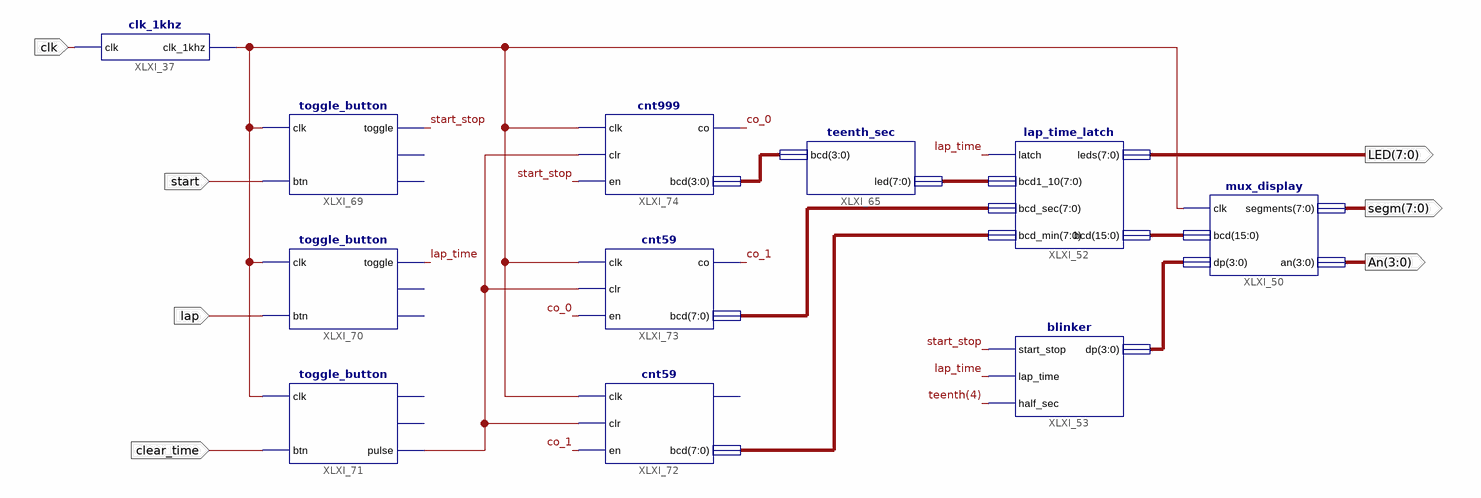
[diagram p0: schematic sheet 1]
// Xilinx ISE schematic top_layer.sch (spartan3e) as structural Verilog: 11 symbols, 7 ports
module top_layer (
  input  start,
  input  lap,
  input  clear_time,
  input  clk,
  output [7:0] LED,
  output [7:0] segm,
  output [3:0] An
);

  wire co_0, co_1, lap_time, start_stop, XLXN_136, XLXN_228;
  wire [3:0] XLXN_175, XLXN_197;
  wire [7:0] teenth, XLXN_178, XLXN_179;
  wire [15:0] XLXN_180;

  clk_1khz XLXI_37 (.clk(clk), .clk_1khz(XLXN_136));
  mux_display XLXI_50 (.clk(XLXN_136), .bcd(XLXN_180), .dp(XLXN_197), .segments(segm), .an(An));
  lap_time_latch XLXI_52 (
    .latch(lap_time), .bcd1_10(teenth), .bcd_sec(XLXN_178), .bcd_min(XLXN_179), .leds(LED), .bcd(XLXN_180));
  blinker XLXI_53 (.start_stop(start_stop), .lap_time(lap_time), .half_sec(teenth[4]), .dp(XLXN_197));
  teenth_sec XLXI_65 (.bcd(XLXN_175), .led(teenth));
  toggle_button XLXI_69 (.clk(XLXN_136), .btn(start), .toggle(start_stop));  // open: debounce, pulse
  toggle_button XLXI_70 (.clk(XLXN_136), .btn(lap), .toggle(lap_time));  // open: debounce, pulse
  toggle_button XLXI_71 (.clk(XLXN_136), .btn(clear_time), .pulse(XLXN_228));  // open: toggle, debounce
  cnt59 XLXI_72 (.clk(XLXN_136), .clr(XLXN_228), .en(co_1), .bcd(XLXN_179));  // open: co
  cnt59 XLXI_73 (.clk(XLXN_136), .clr(XLXN_228), .en(co_0), .co(co_1), .bcd(XLXN_178));
  cnt999 XLXI_74 (.clk(XLXN_136), .clr(XLXN_228), .en(start_stop), .co(co_0), .bcd(XLXN_175));
endmodule
